# EAGLE design controller (EAGLE 5.11)
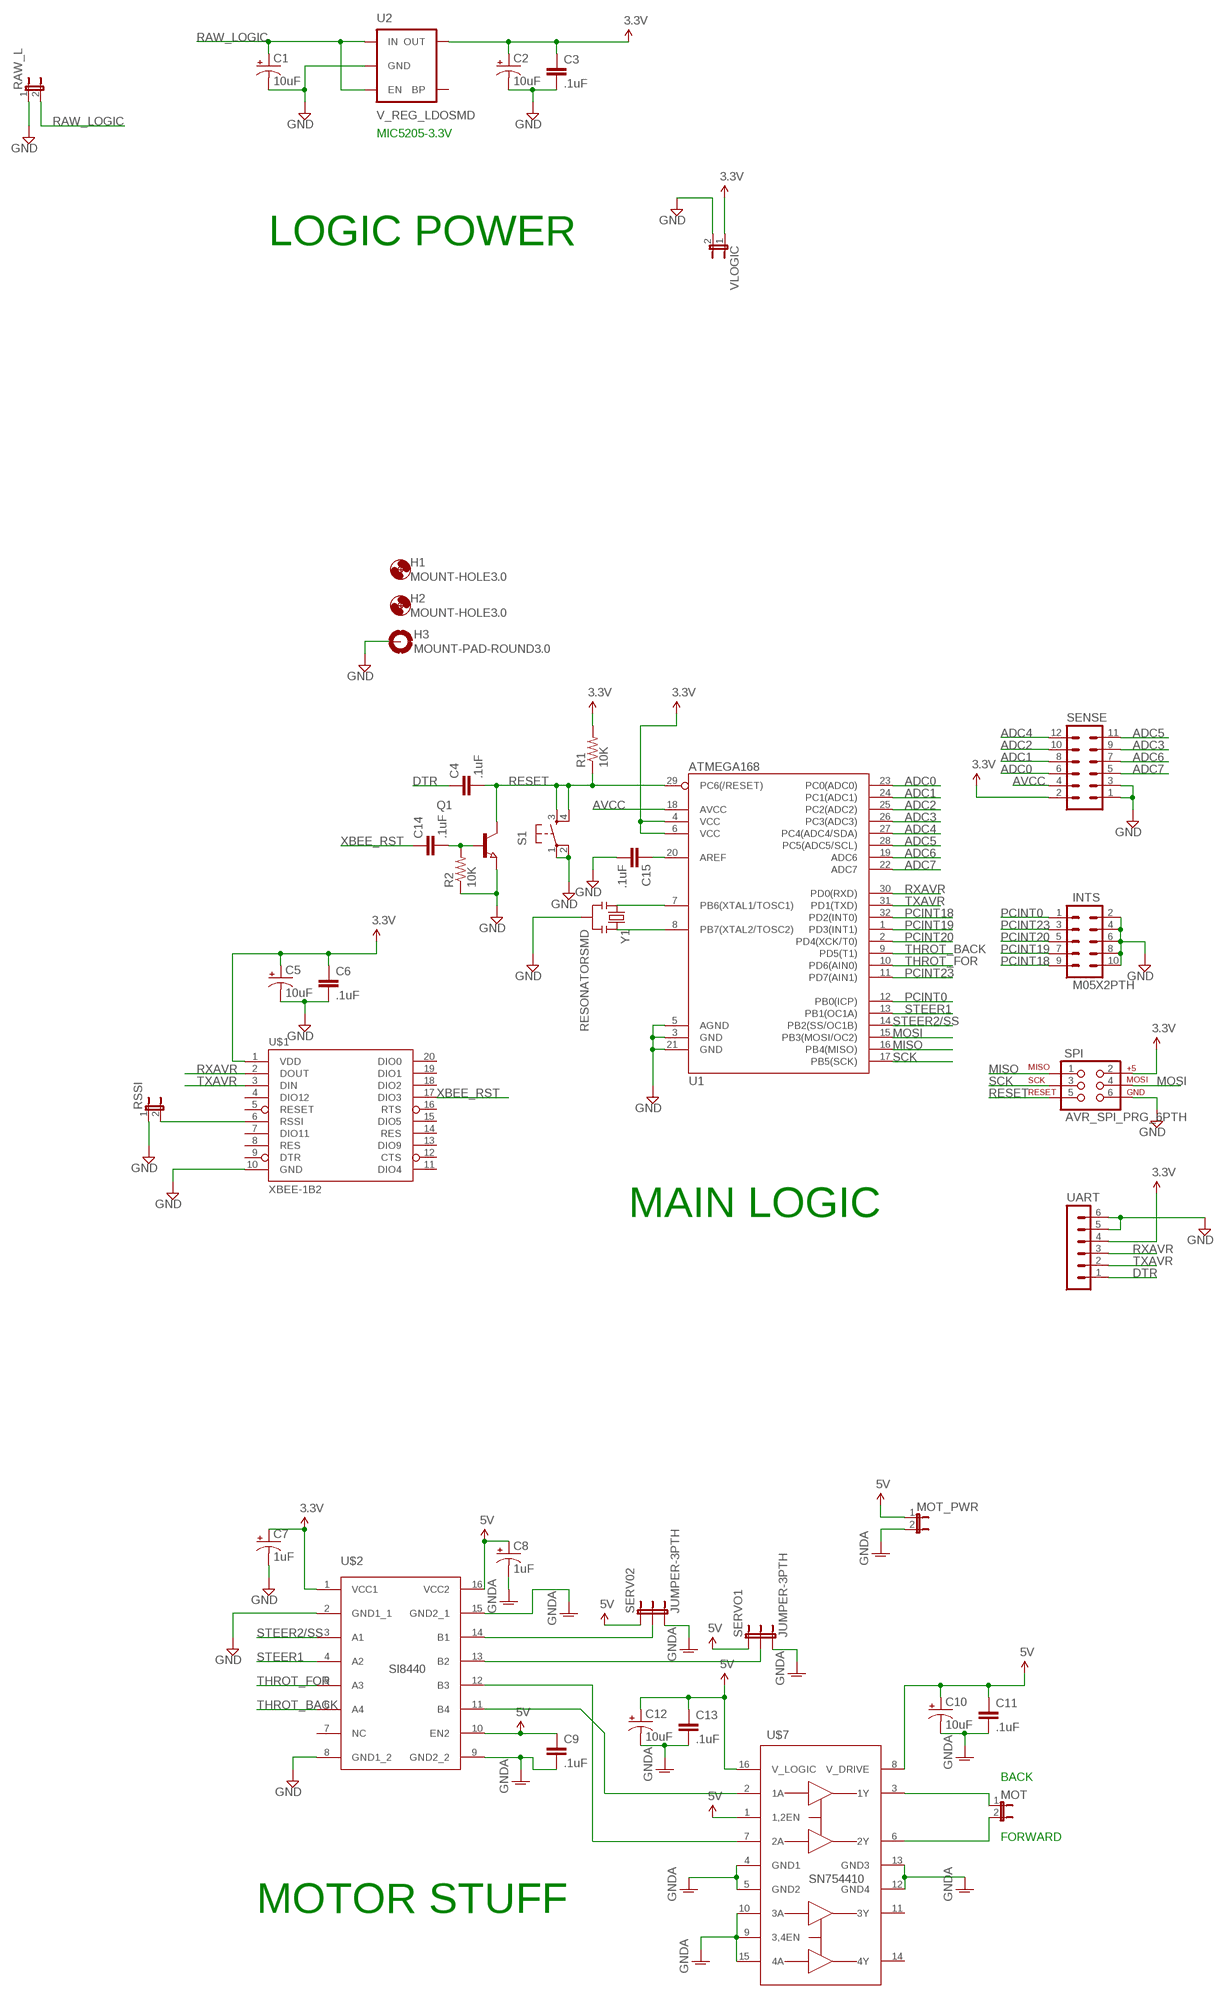
[diagram p0: schematic, sheet 1]

## Parts
C1  10uF  CAP_POL1206  [EIA3216]
C2  10uF  CAP_POL1206  [EIA3216]
C3  .1uF  CAP0402-CAP  [0402-CAP]
C4  .1uF  CAP0402-CAP  [0402-CAP]
C5  10uF  CAP_POL1206  [EIA3216]
C6  .1uF  CAP0402-CAP  [0402-CAP]
C7  1uF  CAP_POL1206  [EIA3216]
C8  1uF  CAP_POL1206  [EIA3216]
C9  .1uF  CAP0402-CAP  [0402-CAP]
C10  10uF  CAP_POL1206  [EIA3216]
C11  .1uF  CAP0402-CAP  [0402-CAP]
C12  10uF  CAP_POL1206  [EIA3216]
C13  .1uF  CAP0402-CAP  [0402-CAP]
C14  .1uF  CAP0402-CAP  [0402-CAP]
C15  .1uF  CAP0402-CAP  [0402-CAP]
H1  MOUNT-HOLE3.0  [3,0]
H2  MOUNT-HOLE3.0  [3,0]
H3  MOUNT-PAD-ROUND3.0  [3,0-PAD]
INTS  M05X2PTH  [AVR_ICSP]
MOT  JUMPER-2PTH  [1X02]
MOT_PWR  JUMPER-2PTH  [1X02]
Q1  NPN-TRANSISTOR_SOT23  [SOT23]
R1  10K  RESISTOR0402-RES  [0402-RES]
R2  10K  RESISTOR0402-RES  [0402-RES]
RAW_L  JUMPER-2PTH  [1X02]
RSSI  JUMPER-2PTH  [1X02]
S1  TAC_SWITCHSMD  [TACTILE_SWITCH_SMD]
SENSE  MA06-2  [MA06-2]
SERV02  JUMPER-3PTH  [1X03]
SERVO1  JUMPER-3PTH  [1X03]
SPI  AVR_SPI_PRG_6PTH  [2X3]
U1  ATMEGA168  [TQFP32-08]
U2  V_REG_LDOSMD  [SOT23-5]
U$1  XBEE-1B2  [XBEE-SILK]
U$2  SI8440  [SOIC16R]
U$7  SN754410  [DIL16]
UART  MA06-1  [MA06-1]
VLOGIC  JUMPER-2PTH  [1X02]
Y1  RESONATORSMD  [RESONATOR-SMD]

## Nets
3.3V: C2.A(+) C3.1 C5.A(+) C6.1 C7.A(+) R1.2 SENSE.2 SPI.2 U1.4(VCC) U1.6(VCC) U2.5(OUT) U$1.1(VDD) U$2.1(VCC1) UART.4 VLOGIC.1
5V: C8.A(+) C9.1 C10.A(+) C11.1 C12.A(+) C13.1 MOT_PWR.1 SERV02.1 SERVO1.1 U$2.10(EN2) U$2.16(VCC2) U$7.1(1,2EN) U$7.8(V_DRIVE) U$7.16(V_LOGIC)
ADC0: SENSE.6 U1.23(PC0(ADC0))
ADC1: SENSE.8 U1.24(PC1(ADC1))
ADC2: SENSE.10 U1.25(PC2(ADC2))
ADC3: SENSE.9 U1.26(PC3(ADC3))
ADC4: SENSE.12 U1.27(PC4(ADC4/SDA))
ADC5: SENSE.11 U1.28(PC5(ADC5/SCL))
ADC6: SENSE.7 U1.19(ADC6)
ADC7: SENSE.5 U1.22(ADC7)
AVCC: SENSE.4 U1.18(AVCC)
DTR: C4.1 UART.1
GND: C1.C(-) C2.C(-) C3.2 C5.C(-) C6.2 C7.C(-) C15.2 H3.B3,0(MOUNT) INTS.2 INTS.4 INTS.6 INTS.8 INTS.10 Q1.2(E) R2.1 RAW_L.1 RSSI.1 S1.1 S1.2 SENSE.1 SENSE.3 SPI.6 U1.3(GND) U1.5(AGND) U1.21(GND) U2.2(GND) U$1.10(GND) U$2.2(GND1_1) U$2.8(GND1_2) UART.5 UART.6 VLOGIC.2 Y1.2
GNDA: C8.C(-) C9.2 C10.C(-) C11.2 C12.C(-) C13.2 MOT_PWR.2 SERV02.3 SERVO1.3 U$2.9(GND2_2) U$2.15(GND2_1) U$7.4(GND1) U$7.5(GND2) U$7.9(3,4EN) U$7.10(3A) U$7.12(GND4) U$7.13(GND3) U$7.15(4A)
MISO: SPI.1 U1.16(PB4(MISO))
MOSI: SPI.4 U1.15(PB3(MOSI/OC2))
N$1: RSSI.2 U$1.6(RSSI)
N$2: U1.7(PB6(XTAL1/TOSC1)) Y1.1
N$3: U1.8(PB7(XTAL2/TOSC2)) Y1.3
N$6: C14.2 Q1.1(B) R2.2
N$8: SERV02.2 U$2.14(B1)
N$9: SERVO1.2 U$2.13(B2)
N$10: U$2.11(B4) U$7.2(1A)
N$11: U$2.12(B3) U$7.7(2A)
N$12: MOT.1 U$7.3(1Y)
N$13: MOT.2 U$7.6(2Y)
N$19: C15.1 U1.20(AREF)
PCINT0: INTS.1 U1.12(PB0(ICP))
PCINT18: INTS.9 U1.32(PD2(INT0))
PCINT19: INTS.7 U1.1(PD3(INT1))
PCINT20: INTS.5 U1.2(PD4(XCK/T0))
PCINT23: INTS.3 U1.11(PD7(AIN1))
RAW_LOGIC: C1.A(+) RAW_L.2 U2.1(IN) U2.3(EN)
RESET: C4.2 Q1.3(C) R1.1 S1.3 S1.4 SPI.5 U1.29(PC6(/RESET))
RXAVR: U1.30(PD0(RXD)) U$1.2(DOUT) UART.3
SCK: SPI.3 U1.17(PB5(SCK))
STEER1: U1.13(PB1(OC1A)) U$2.4(A2)
STEER2/SS: U1.14(PB2(SS/OC1B)) U$2.3(A1)
THROT_BACK: U1.9(PD5(T1)) U$2.6(A4)
THROT_FOR: U1.10(PD6(AIN0)) U$2.5(A3)
TXAVR: U1.31(PD1(TXD)) U$1.3(DIN) UART.2
XBEE_RST: C14.1 U$1.17(DIO3)
Unconnected: U2.4(BP) U$1.4(DIO12) U$1.5(RESET) U$1.7(DIO11) U$1.8(RES) U$1.9(DTR) U$1.11(DIO4) U$1.12(CTS) U$1.13(DIO9) U$1.14(RES) U$1.15(DIO5) U$1.16(RTS) U$1.18(DIO2) U$1.19(DIO1) U$1.20(DIO0) U$2.7(NC) U$7.11(3Y) U$7.14(4Y)

## Notes on the sheet
- MIC5205-3.3V
- LOGIC POWER
- MAIN LOGIC
- BACK
- FORWARD
- MOTOR STUFF

## Library data of the parts
C1 C2 C5 C7 C8 C10 C12 = SparkFun:CAP_POL: Capacitor Polarized These are standard SMD and PTH capacitors. Normally 10uF, 47uF, and 100uF in electrolytic and tantalum varieties. Always verify the external diameter of the through hole cap, it varies with capacity, voltage, and manufacturer. The EIA devices should be standard.
C3 C4 C6 C9 C11 C13-C15 = SparkFun:CAP: Capacitor Standard 0603 ceramic capacitor, and 0.1" leaded capacitor.
H1 H2 = holes:MOUNT-HOLE: MOUNTING HOLE with drill center marker
H3 = holes:MOUNT-PAD-ROUND: MOUNTING PAD, round
INTS = SparkFun:M05X2: Header 5x2 Standard 10-pin dual row 0.1" header. Commonly used with AVR-ISP. Use with Spark Fun Electronics SKU: PRT-00778
MOT MOT_PWR RAW_L RSSI VLOGIC = SparkFun:JUMPER-2: Jumper Basic 0.1" spaced jumper. Use with breakaway headers.
Q1 = semicon-smd-ipc:NPN-TRANSISTOR_: NPN TRANSISTOR
R1 R2 = SparkFun:RESISTOR: Resistor Basic schematic elements and footprints for 0603, 1206, and PTH resistors.
S1 = SparkFun:TAC_SWITCH: Momentary Switch Button commonly used for reset or general input. Spark Fun Electronics SKU : COM-00097
SENSE = con-lstb:MA06-2: PIN HEADER; OC_FARNELL: unknown; OC_NEWARK: unknown
SERV02 SERVO1 = SparkFun:JUMPER-3
SPI = SparkFun:AVR_SPI_PRG_6: AVR ISP 6 Pin This is the reduced ISP connector for AVR programming. Common on Arduino. This footprint will take up less PCB space and can be used with a 10-pin to 6-pin adapter such as SKU: BOB-08508
U1 = SparkFun:ATMEGA168
U2 = SparkFun:V_REG_LDO: Voltage Regulator LDO Standard 150mA LDO voltage regulator in SOT-23 layout. Micrel part MIC5205. BP (by-pass) pin is used to lower output noise with 470pF cap.
U$1 = SparkFun:XBEE-1
U$2 = swarm:SI8440
U$7 = swarm:SN754410
UART = con-lstb:MA06-1: PIN HEADER; OC_FARNELL: unknown; OC_NEWARK: unknown
Y1 = SparkFun:RESONATOR: Resonator Small SMD resonator. This is the itty bitty 10/20MHz resonators with built in caps. CSTCE10M0G55 and CSTCE20M0V53. Footprint has been reviewed closely but hasn't been tested yet.

## Board
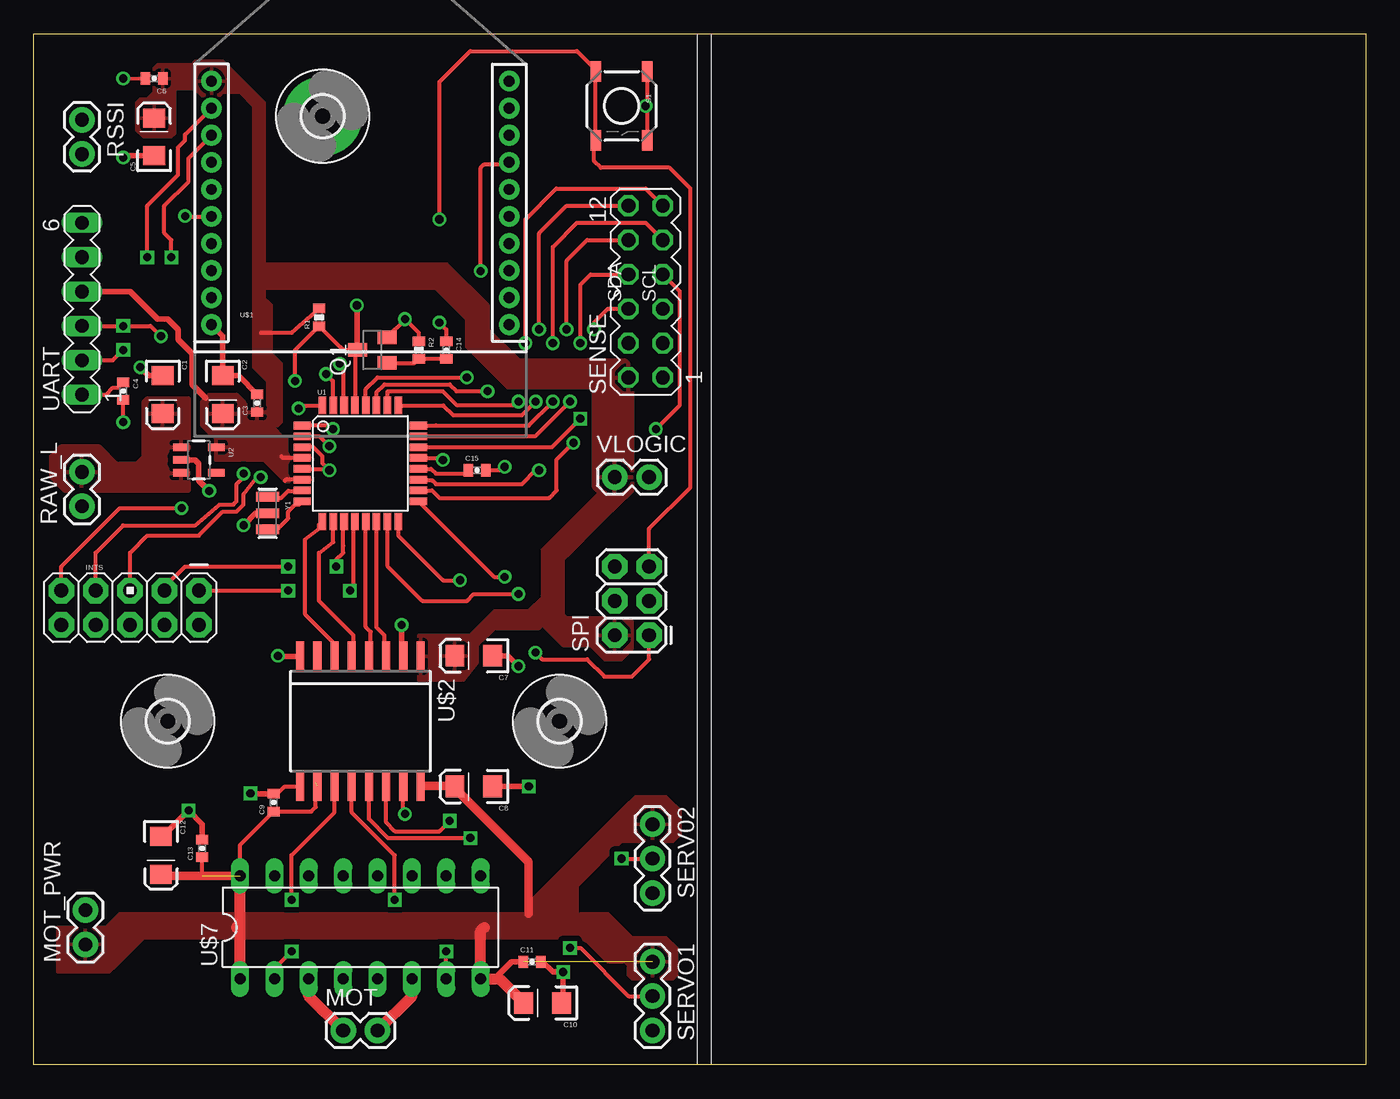
[diagram p1: board, top side]
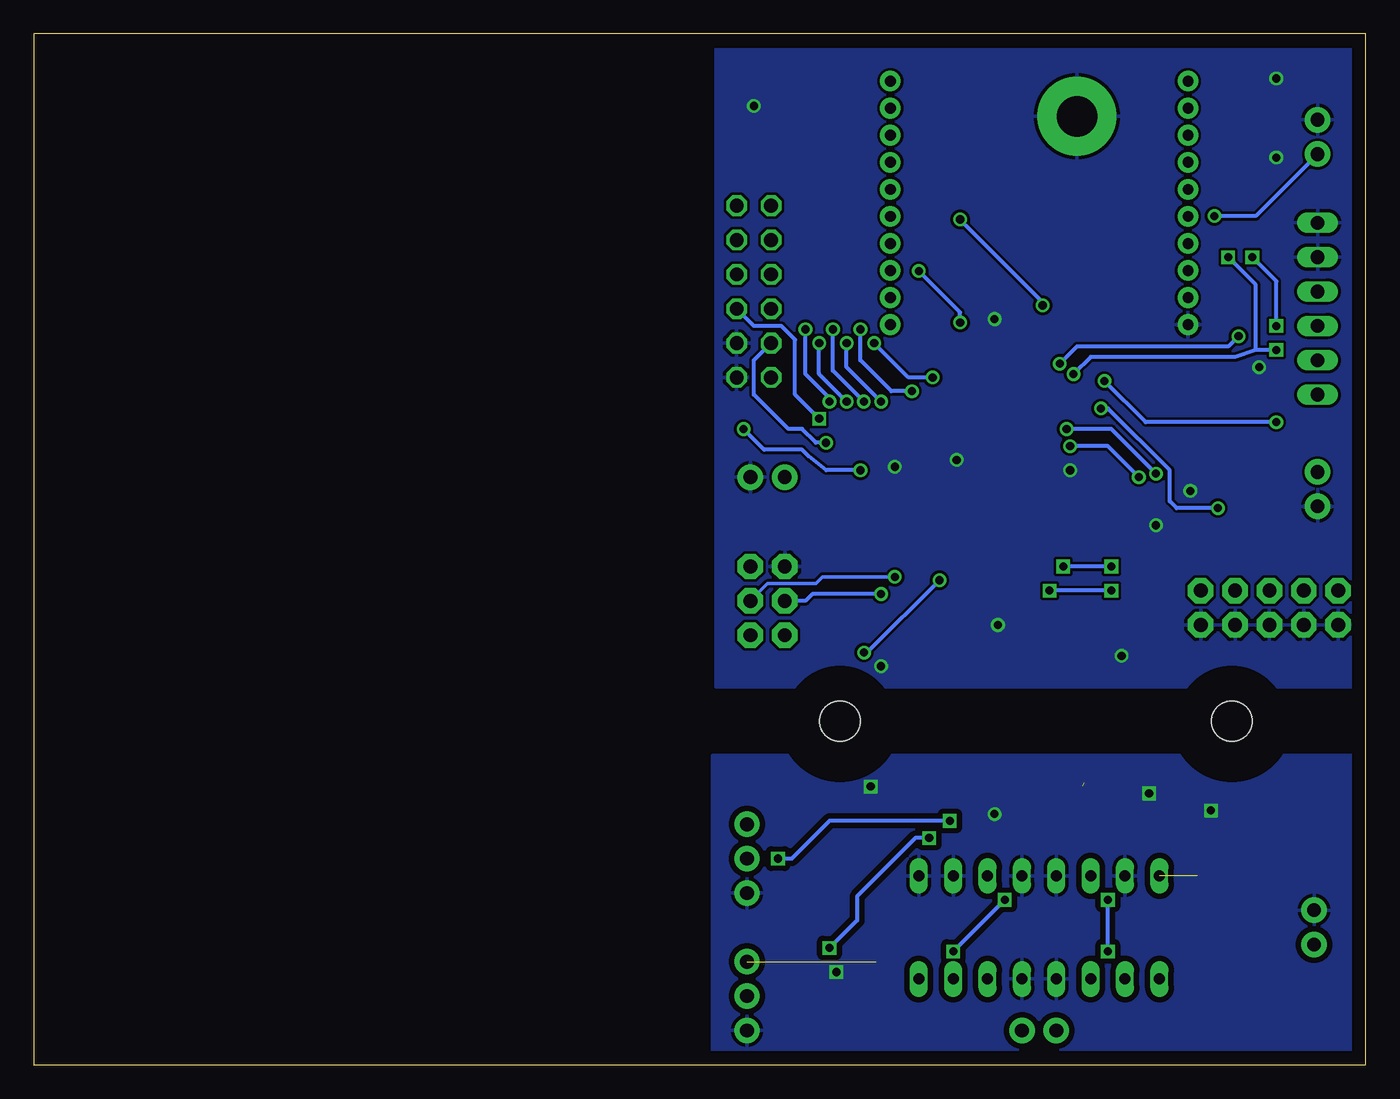
[diagram p2: board, bottom side, seen from below]

Size 98.42 x 76.2 mm. Coordinates in mm from the lower left corner, seen from the top.
Outline: 0,0 0,76.2 98.42,76.2 98.42,0 0,0
Copper layers (1*16): Top 0.035mm / dielectric 1.5mm / Bottom 0.035mm
Design rules "default *": minimum track width 10mil, minimum drill 20mil, track to track 8mil, track to pad 8mil, pad to pad 8mil, via to via 8mil, smd to smd 8mil, copper to edge 40mil, drill to drill 8mil, minimum pad ring 10mil, minimum via ring 8mil, stop-mask expansion 4mil, vias tented up to drill 0mil, thermal gap 10mil

### Footprints (pad centres in the part's own frame; a part is rotated, then mirrored left to right if it is on the bottom)
EIA3216 = smd 1.4 x 1.6: A 1.4,0; C -1.4,0
0402-CAP = smd 0.7 x 0.9: 1 -0.65,0; 2 0.65,0
3,0 = hole 3: 0,0
3,0-PAD = drill 3 pad 5.842 round: B3,0 0,0
AVR_ICSP = drill 1.016 pad 1.88 octagon: 1 -1.27,5.08; 2 1.27,5.08; 3 -1.27,2.54; 4 1.27,2.54; 5 -1.27,0; 6 1.27,0; 7 -1.27,-2.54; 8 1.27,-2.54; 9 -1.27,-5.08; 10 1.27,-5.08
1X02 = drill 1.016 pad 1.88 round: 1 0,0; 2 2.54,0
SOT23 = smd 1 x 1.4: 1 -0.95,-1.1; 2 0.95,-1.1; 3 0,1.1
0402-RES = smd 0.7 x 0.9: 1 -0.65,0; 2 0.65,0
TACTILE_SWITCH_SMD = smd 1.524 x 0.762: 1 -2.54,1.905; 2 2.54,1.905; 3 -2.54,-1.905; 4 2.54,-1.905
MA06-2 = drill 1.016 octagon: 1 -6.35,-1.27; 2 -6.35,1.27; 3 -3.81,-1.27; 4 -3.81,1.27; 5 -1.27,-1.27; 6 -1.27,1.27; 7 1.27,-1.27; 8 1.27,1.27; 9 3.81,-1.27; 10 3.81,1.27; 11 6.35,-1.27; 12 6.35,1.27
1X03 = drill 1.016 pad 1.88 round: 1 0,0; 2 2.54,0; 3 5.08,0
2X3 = drill 1.016 pad 1.88 octagon: 1 0,0; 2 0,2.54; 3 2.54,0; 4 2.54,2.54; 5 5.08,0; 6 5.08,2.54
TQFP32-08 = smd 1.27 x 0.559: 1 -4.293,2.8; 2 -4.293,2; 3 -4.293,1.2; 4 -4.293,0.4; 5 -4.293,-0.4; 6 -4.293,-1.2; 7 -4.293,-2; 8 -4.293,-2.8; 17 4.293,-2.8; 18 4.293,-2; 19 4.293,-1.2; 20 4.293,-0.4; 21 4.293,0.4; 22 4.293,1.2; 23 4.293,2; 24 4.293,2.8 | smd 0.559 x 1.27: 9 -2.8,-4.293; 10 -2,-4.293; 11 -1.2,-4.293; 12 -0.4,-4.293; 13 0.4,-4.293; 14 1.2,-4.293; 15 2,-4.293; 16 2.8,-4.293; 25 2.8,4.293; 26 2,4.293; 27 1.2,4.293; 28 0.4,4.293; 29 -0.4,4.293; 30 -1.2,4.293; 31 -2,4.293; 32 -2.8,4.293
SOT23-5 = smd 0.55 x 1.2: 1 -0.95,-1.3; 2 0,-1.3; 3 0.95,-1.3; 4 0.95,1.3; 5 -0.95,1.3
XBEE-SILK = drill 0.8 pad 1.524 round: 1 -11,20; 2 -11,18; 3 -11,16; 4 -11,14; 5 -11,12; 6 -11,10; 7 -11,8; 8 -11,6; 9 -11,4; 10 -11,2; 11 11,2; 12 11,4; 13 11,6; 14 11,8; 15 11,10; 16 11,12; 17 11,14; 18 11,16; 19 11,18; 20 11,20
SOIC16R = smd 0.6 x 2.2: 1 -4.445,-4.775; 2 -3.175,-4.775; 3 -1.905,-4.775; 4 -0.635,-4.775; 5 0.635,-4.775; 6 1.905,-4.775; 7 3.175,-4.775; 8 4.445,-4.775; 9 4.445,4.8; 10 3.175,4.8; 11 1.905,4.8; 12 0.635,4.8; 13 -0.635,4.8; 14 -1.905,4.8; 15 -3.175,4.8; 16 -4.445,4.8
DIL16 = drill 0.813 long: 1 -8.89,-3.81; 2 -6.35,-3.81; 3 -3.81,-3.81; 4 -1.27,-3.81; 5 1.27,-3.81; 6 3.81,-3.81; 7 6.35,-3.81; 8 8.89,-3.81; 9 8.89,3.81; 10 6.35,3.81; 11 3.81,3.81; 12 1.27,3.81; 13 -1.27,3.81; 14 -3.81,3.81; 15 -6.35,3.81; 16 -8.89,3.81
MA06-1 = drill 1.016 long: 1 -6.35,0; 2 -3.81,0; 3 -1.27,0; 4 1.27,0; 5 3.81,0; 6 6.35,0
RESONATOR-SMD = smd 0.7 x 1.7: 1 -1.2,0; 2 0,0; 3 1.2,0

### Placement (x,y rotation side)
C1  9.53,49.53 270 top
C2  13.97,49.53 270 top
C3  16.51,48.9 90 top
C4  6.6,49.78 270 top
C5  8.89,68.58 90 top
C6  8.89,72.9 180 top
C7  32.51,30.23 180 top
C8  32.51,20.57 180 top
C9  17.73,19.38 90 top
C10  37.59,4.57 180 top
C11  36.83,7.62 0 top
C12  9.4,15.49 270 top
C13  12.45,16 90 top
C14  30.48,52.83 270 top
C15  32.77,43.94 0 top
H1  9.91,25.4 0 top
H2  38.86,25.4 0 top
H3  21.34,70.1 0 top
INTS  7.11,33.78 270 top
MOT  22.86,2.54 0 top
MOT_PWR  3.81,8.89 90 top
Q1  25.02,52.83 90 top
R1  21.08,55.24 90 top
R2  28.45,52.83 270 top
RAW_L  3.56,41.27 90 top
RSSI  3.56,69.85 270 top
S1  43.43,70.87 270 top
SENSE  45.21,57.15 90 top
SERV02  45.72,17.78 270 top
SERVO1  45.72,7.62 270 top
SPI  45.47,31.75 90 top
U1  24.13,44.45 0 top
U2  12.19,44.7 270 top
U$1  24.13,52.7 0 top
U$2  24.13,25.4 180 top
U$7  24.13,10.16 0 top
UART  3.56,55.88 90 top
VLOGIC  42.93,43.43 0 top
Y1  17.27,40.77 270 top

### Tracks (layer width: path | path; a pad name or v marks a point on that pad's centre or on a via)
3.3V
  Top 0.305: R1.2 19.07,54.12 16.76,54.1 | U1.4 18.4,44.85 18.29,44.96 | U1.6 18.61,43.25 18.54,43.18
  Top 0.406: UART.4 7.11,57.15 9.14,55.12 9.91,55.12 10.67,54.36 10.67,53.59 10.92,53.34 11.68,52.58 11.68,50.29 12.7,49.28
  pour Top (isolate 0.406): 13.46,46.48 13.21,46.48 12.45,47.24 12.45,49.02 12.95,49.53 14.99,49.53 15.49,49.02 17.27,49.02 17.53,48.77 17.53,47.24 18.54,46.23 20.57,46.23 20.57,42.93 18.8,42.93 17.02,44.7 13.46,44.7
  pour Top: 8.89,68.58 8.13,68.58 7.62,69.09 7.62,71.12 7.87,71.37 8.38,71.37 8.89,71.88 8.89,73.66 9.14,73.91 11.68,73.91 11.94,74.17 13.97,74.17 14.22,73.91 17.02,71.12 17.02,52.32 18.29,51.05 18.29,47.5 18.03,47.24 17.53,47.24 17.27,47.5 17.27,50.55 17.02,50.8 16.26,51.56 16.26,70.87 15.24,71.88 13.97,71.88 13.72,71.63 12.45,71.63 12.19,71.88 11.94,72.14 10.41,72.14 10.41,68.83 10.16,68.58
  pour Top: 30.48,59.18 33.53,56.13 33.53,54.36 35.81,52.07 43.69,52.07 44.2,51.56 44.2,42.42 43.69,41.91 42.16,41.91 41.4,42.67 41.4,49.78 41.15,50.04 35.05,50.04 32,53.09 32,55.12 30.99,56.13 29.72,57.4 16.76,57.4 16.76,59.18
  pour Top: 28.45,28.45 28.45,31.75 32.26,31.75 34.04,33.53 36.58,33.53 37.59,34.54 37.59,32.51 37.34,32.26 34.04,32.26 32.77,30.99 32.77,29.72 31.75,28.45
  pour Top: 18.29,51.05 18.29,51.82 17.53,52.58 17.53,56.13 16.76,56.9 16.76,55.63 16.76,51.82 17.78,50.8 18.03,51.05
  pour Top: 44.2,42.42 41.15,39.37 40.13,38.35 39.88,38.1 39.62,37.85 39.12,37.34 39.12,33.27 39.37,33.02 43.69,33.02 43.94,33.02 44.2,32.77 44.2,30.73 43.69,30.23 43.43,29.97 42.16,29.97 41.66,30.48 41.15,30.99 39.12,30.99 38.86,31.24 37.59,32.51 37.59,38.1 38.1,38.61 41.91,42.42
5V  (3 unrouted)
  Top 0.305: U$7.16 15.24,16.24 C9.1 20.51,18.73 20.83,19.05 20.83,20.83 21.08,21.08 | 12.45,13.97 C13.1
  Top 0.406: C11.1 35.31,7.62 34.04,6.35
  Top 0.61: U$2.16 31.09,20.6 C8.A 31.11,20.45 36.58,14.99 36.58,11.18 | U$7.16 9.52,13.97
  Top 0.813: 15.24,10.41 U$7.16 | 15.24,10.41 14.99,10.16 | U$7.1 15.24,10.41 | 33.27,10.16 33.02,9.91 U$7.8 34.04,6.35 34.41,6.35 C10.A | 9.52,13.97 C12.A
  pour Top (isolate 0.406): 1.78,9.65 1.78,6.86 5.59,6.86 6.1,7.37 7.37,8.64 7.87,9.14 8.13,9.4 40.13,9.4 40.13,11.18 6.35,11.18 5.33,10.16 1.78,10.16
  pour Top (isolate 0.406): 47.24,16.51 47.75,17.02 47.75,18.8 46.99,19.56 46.74,19.81 44.45,19.81 43.69,19.05 36.83,12.19 36.83,11.18 40.13,11.18 40.13,13.21 43.43,16.51
  pour Top (isolate 0.406): 40.39,11.18 42.42,11.18 44.2,9.4 46.74,9.4 47.5,8.64 47.5,6.6 47.24,6.35 44.2,6.35 43.94,6.6 43.94,7.37 43.69,7.62 42.16,7.62 40.39,9.4
ADC0  (via drill 0.6)
  Top 0.305: SENSE.6 42.42,55.88 41.4,54.86 v41.4,54.36 | v39.62,49.02 37.08,46.48 28.42,46.48 U1.23
  Bottom 0.305: v41.4,54.36 41.4,51.05 39.62,49.28 v39.62,49.02
ADC1  (via drill 0.6)
  Top 0.305: SENSE.8 41.15,58.42 40.39,57.66 v40.39,53.34 | v38.35,49.02 36.58,47.24 29.72,47.24 29.72,47.25 U1.24
  Bottom 0.305: v40.39,53.34 40.39,51.05 v38.35,49.02
ADC2  (via drill 0.6)
  Top 0.305: U1.25 30.25,48.74 30.99,48.01 36.07,48.01 v37.08,49.02 | v39.37,54.36 39.37,59.44 40.89,60.96 SENSE.10
  Bottom 0.305: v37.08,49.02 39.37,51.31 v39.37,54.36
ADC3  (via drill 0.6)
  Top 0.305: U1.26 26.13,49.75 26.16,49.78 30.23,49.78 31.24,48.77 35.56,48.77 v35.81,49.02 | v38.35,53.34 38.35,60.45 40.13,62.23 45.21,62.23 SENSE.9
  Bottom 0.305: v35.81,49.02 38.35,51.56 v38.35,53.34
ADC4  (via drill 0.6)
  Top 0.305: U1.27 25.33,49.71 25.91,50.29 30.73,50.29 31.24,49.78 v33.53,49.78 | v37.34,54.36 37.34,61.47 39.37,63.5 SENSE.12
  Bottom 0.305: v33.53,49.78 35.05,49.78 37.34,52.07 v37.34,54.36
ADC5  (via drill 0.6)
  Top 0.305: U1.28 24.53,49.93 25.4,50.8 v32,50.8 | v36.32,53.34 36.32,62.48 38.61,64.77 45.21,64.77 SENSE.11
  Bottom 0.305: v32,50.8 33.78,50.8 v36.32,53.34
ADC6  (via drill 0.6)
  Top 0.305: SENSE.7 47.75,57.15 47.75,48.77 v45.97,46.99 | v37.34,43.94 37.08,43.94 36.07,42.93 29.72,42.93 29.46,43.18 28.49,43.18 U1.19
  Bottom 0.305: v45.97,46.99 44.45,45.47 41.66,45.47 41.15,44.96 39.88,43.94 v37.34,43.94
ADC7  (via drill 0.6)
  Top 0.305: U1.22 38.28,45.65 v40.39,47.75
  Bottom 0.305: v40.39,47.75 42.16,49.53 42.16,53.59 43.18,54.61 45.21,54.61 SENSE.5
AVCC  (via drill 0.6)
  Top 0.305: U1.18 29.43,42.45 29.97,41.91 38.1,41.91 38.64,42.45 38.64,44.74 v39.88,45.97
  Bottom 0.305: SENSE.4 45.21,52.07 45.21,49.53 42.67,46.99 41.66,46.99 40.64,45.97 v39.88,45.97
DTR
  Top 0.305: UART.1 5.33,49.53 5.84,50.04 6.21,50.04 C4.1
GND  (via drill 0.6)
  Top 0.254: v6.6,72.9 C6.2
  Top 0.305: 26.42,53.48 Q1.2 27.43,55.09 v27.43,55.12 28.45,54.1 R2.1 | U1.21 30.08,44.85 v30.23,44.7 | U1.5 21.74,44.05 v21.84,43.94 21.34,44.45 21.34,44.96 20.64,45.65 U1.3 | C15.2 34.54,43.94 v34.8,44.2 | S1.1 45.34,70.99 v45.21,70.87 45.34,70.74 S1.2
  Top 0.406: U$1.10 13.97,53.87 C2.C 15.12,50.93 C3.2 | C5.C 6.73,67.18 v6.6,67.06 | C1.C 8.51,50.93 v7.87,51.56 | U2.2 11.94,44.7 12.19,44.45 12.19,43.18 v12.95,42.42 | Y1.2 16.38,40.77 v15.49,39.88 | C7.C 35.05,30.23 v35.81,29.46 | U$2.8 18.09,30.18 v18.03,30.23 | v27.18,32.51 27.18,30.3 U$2.2
  pour Bottom: 19.81,27.94 1.02,27.94 1.02,75.18 48.01,75.18 48.01,27.94
GNDA  (via drill 0.6)
  Top 0.305: C9.2 18,20.03 18.54,20.57 19.66,20.57 U$2.9 19.56,20.73 | U$2.15 27.3,18.67 v27.43,18.54
  Top 0.406: C12.C 9.53,16.89 v11.43,18.8 12.45,17.78 C13.2 | C9.2 16.04,20.03 v16,20.07 | C8.C v36.58,20.57 | C11.2 37.59,7.62 38.35,6.86 v39.12,6.86 39.12,4.7 C10.C
  pour Bottom (isolate 0.406): 0.76,0.76 48.26,0.76 48.26,22.86 0.76,22.86
MISO  (via drill 0.6)
  Top 0.305: v31.5,35.81 30.26,35.81 27.43,38.61 26.93,39.11 U1.16 | SPI.1 45.47,29.97 44.2,28.7 42.16,28.7 40.89,29.97 37.57,29.97 v37.07,30.47
  Bottom 0.305: v37.07,30.47 36.84,30.47 v31.5,35.81
MOSI  (via drill 0.6)
  Top 0.305: U1.15 26.16,40.12 26.16,36.83 28.7,34.29 32,34.29 32.51,34.8 v35.81,34.8
  Bottom 0.305: v35.81,34.8 40.89,34.8 41.4,34.29 SPI.4
N$1  (via drill 0.6)
  Top 0.305: 11.21,62.7 U$1.6
  Top 0.406: v11.18,62.74 11.21,62.7
  Bottom 0.305: v11.18,62.74 8.13,62.74 RSSI.2
N$2
  Top 0.305: U1.7 19.8,42.42 18.8,42.42 18.29,41.91 17.33,41.91 Y1.1
N$3
  Top 0.305: U1.8 19.59,41.4 19.3,41.4 18.8,40.89 18.8,40.39 17.98,39.57 Y1.3
N$6
  Top 0.305: R2.2 28.57,52.31 | R2.2 C14.2 | Q1.1 28.15,51.88 R2.2
N$8  (via drill 0.6)
  Top 0.305: v43.43,15.24 SERV02.2 | U$2.14 26.04,17.91 26.67,17.27 29.97,17.27 v30.73,18.03
  Bottom 0.305: v30.73,18.03 39.62,18.03 42.42,15.24 v43.43,15.24
N$9  (via drill 0.6)
  Top 0.305: SERVO1.2 43.94,5.08 40.39,8.64 v39.62,8.64 | U$2.13 24.77,18.16 26.16,16.76 v32.26,16.76
  Bottom 0.305: v32.26,16.76 33.27,16.76 37.59,12.45 37.59,10.67 v39.62,8.64
N$10  (via drill 0.6)
  Top 0.305: U$2.11 22.23,18.67 19.05,15.49 v19.05,12.19 | v19.05,8.38 18.03,7.37 18.03,6.6 U$7.2
  Bottom 0.305: v19.05,8.38 v19.05,12.19
N$11  (via drill 0.6)
  Top 0.305: U$2.12 23.5,18.67 26.67,15.49 v26.67,12.19 | U$7.7 v30.48,8.38
  Bottom 0.305: v30.48,8.38 v26.67,12.19
N$12
  Top 0.813: U$7.3 20.32,5.08 MOT.1
N$13
  Top 0.813: U$7.6 27.94,5.08 MOT.2
N$19
  Top 0.305: U1.20 29.36,44.05 29.72,43.69 32.12,43.69 C15.1
PCINT0  (via drill 0.6)
  Top 0.305: INTS.1 v18.8,35.05 | v23.37,35.05 23.62,35.31 23.62,40.05 U1.12
  Bottom 0.305: v18.8,35.05 v23.37,35.05
PCINT18  (via drill 0.6)
  Top 0.305: U1.32 19.79,48.74 v19.56,48.51 | v10.92,41.15 6.35,41.15 2.03,36.83 INTS.9
  Bottom 0.305: v19.56,48.51 19.05,48.51 14.48,43.94 14.48,41.66 13.97,41.15 v10.92,41.15
PCINT19  (via drill 0.6)
  Top 0.305: U1.1 21.84,47.25 v22.1,46.99 | v15.49,43.69 15.49,43.43 14.99,42.93 14.99,41.66 14.73,41.4 13.72,41.4 11.94,39.88 6.6,39.88 4.57,37.85 INTS.7
  Bottom 0.305: v22.1,46.99 18.8,46.99 v15.49,43.69
PCINT20  (via drill 0.6)
  Top 0.305: U1.2 21.11,46.45 v21.84,45.72 | v16.76,43.43 16.51,43.43 15.49,42.16 15.49,41.4 14.99,40.89 13.97,40.89 12.19,39.12 8.38,39.12 7.11,37.85 INTS.5
  Bottom 0.305: v21.84,45.72 19.05,45.72 v16.76,43.43
PCINT23  (via drill 0.6)
  Top 0.305: INTS.3 9.65,35.31 11.18,36.83 v18.8,36.83 | v22.35,36.83 22.35,37.34 22.86,37.85 22.86,38.35 22.86,40.09 U1.11
  Bottom 0.305: v18.8,36.83 v22.35,36.83
RAW_LOGIC
  pour Top (isolate 0.406): 2.29,42.42 1.27,43.43 1.27,44.96 2.03,45.72 4.83,45.72 6.1,44.45 7.62,44.45 8.13,44.96 8.13,49.02 8.38,49.28 11.43,49.28 11.43,44.45 11.43,42.42
RESET  (via drill 0.6)
  Top 0.305: U1.29 23.73,52.64 Q1.3 23.9,52.85 22.84,52.85 22.35,53.34 R1.1 19.3,52.82 v19.3,50.55 | v29.97,62.48 29.97,72.64 32.26,74.93 40.13,74.93 41.53,73.53 S1.3 S1.4 41.4,68.2 41.4,66.8 41.91,66.29 46.99,66.29 48.51,64.77 48.51,42.67 45.47,39.62 SPI.5 | v6.6,47.5 C4.2
  Top 0.406: v23.88,56.13 23.88,52.88 Q1.3
  Bottom 0.305: v6.6,47.5 16.26,47.5 v19.3,50.55 | v23.88,56.13 23.88,56.39 v29.97,62.48
RXAVR  (via drill 0.6)
  Top 0.305: UART.3 v6.6,54.61 8.64,54.61 v9.4,53.85 | v8.38,59.69 8.38,63.5 10.67,65.79 10.67,67.82 11.18,68.33 11.18,68.75 U$1.2 | v22.61,51.82 22.86,51.56 22.86,48.81 U1.30
  Bottom 0.305: v6.6,54.61 6.6,57.91 v8.38,59.69 | v9.4,53.85 10.16,53.09 21.34,53.09 v22.61,51.82
SCK  (via drill 0.6)
  Top 0.305: U1.17 34.01,36.07 v34.8,36.07
  Bottom 0.254: v34.8,36.07 40.13,36.07 40.64,35.56 44.2,35.56 SPI.3
STEER1
  Top 0.305: U1.13 24.53,32.37 24.89,32 24.89,30.3 U$2.4
STEER2/SS
  Top 0.305: U1.14 25.33,32.33 25.91,31.75 25.91,30.3 U$2.3
THROT_BACK
  Top 0.305: U$2.6 22.1,30.3 22.1,31.24 20.07,33.27 20.07,38.86 21.08,39.62 21.08,39.91 U1.9
THROT_FOR
  Top 0.305: U$2.5 23.62,30.3 23.62,31.75 21.08,34.29 21.08,37.85 22.13,38.64 U1.10
TXAVR  (via drill 0.6)
  Top 0.305: UART.2 5.84,52.07 v6.6,52.83 | U$1.3 11.43,67 11.43,65.28 9.65,63.5 9.65,61.47 10.16,60.96 v10.16,59.69 | v21.59,51.05 22.1,50.55 22.1,48.77 U1.31
  Bottom 0.305: v6.6,52.83 8.13,52.83 | 8.13,52.83 8.13,57.66 v10.16,59.69 | 8.13,52.83 9.65,52.32 20.32,52.32 v21.59,51.05
XBEE_RST  (via drill 0.6)
  Top 0.305: C14.1 30.48,54.36 v29.97,54.86 | v33.02,58.67 33.02,66.29 33.27,66.55 34.97,66.55 U$1.17
  Bottom 0.305: v29.97,54.86 29.97,55.63 v33.02,58.67

### Text on the board
_tsilk: SDA | SCL